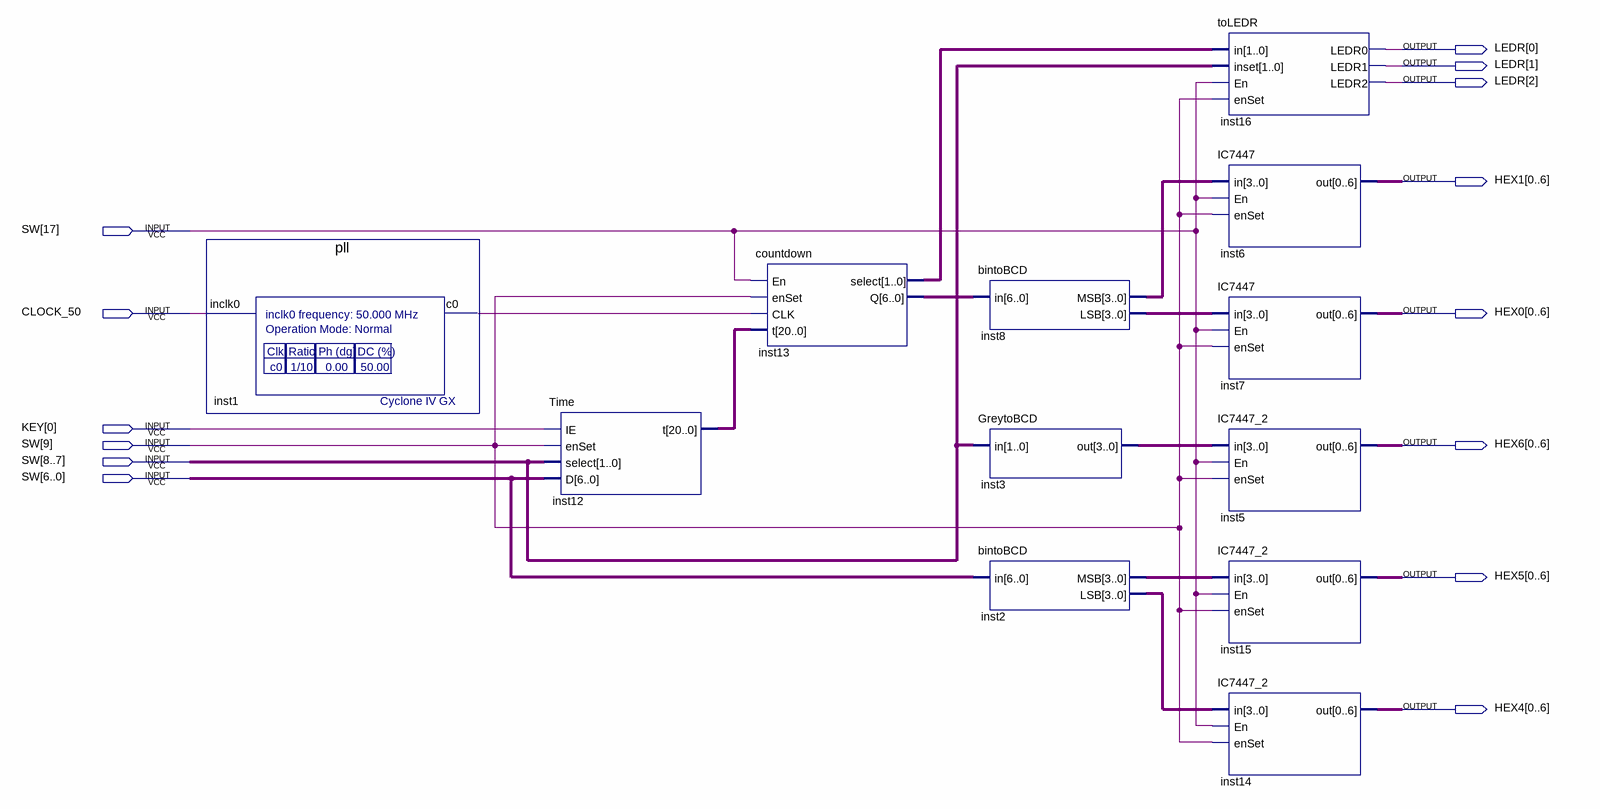
[diagram p0: schematic sheet]
// Quartus schematic MiniProject.bdf as structural Verilog: 12 symbols, 14 pins
module MiniProject (
  input  [17:0] SW,
  input  CLOCK_50,
  input  [0:0] KEY,
  output [2:0] LEDR,
  output [0:6] HEX1,
  output [0:6] HEX0,
  output [0:6] HEX6,
  output [0:6] HEX5,
  output [0:6] HEX4
);

  wire inst1_c0;
  wire [1:0] inst13_select;
  wire [3:0] inst2_lsb, inst2_msb, inst3_out, inst8_lsb, inst8_msb;
  wire [6:0] inst13_q;
  wire [20:0] inst12_t;

  pll inst1 (.inclk0(CLOCK_50), .c0(inst1_c0));
  Time inst12 (.IE(KEY[0]), .enSet(SW[9]), .select(SW[8:7]), .D(SW[6:0]), .t(inst12_t));
  countdown inst13 (.En(SW[17]), .enSet(SW[9]), .CLK(inst1_c0), .t(inst12_t), .select(inst13_select), .Q(inst13_q));
  bintoBCD inst8 (.in(inst13_q), .MSB(inst8_msb), .LSB(inst8_lsb));
  GreytoBCD inst3 (.in(SW[8:7]), .out(inst3_out));
  bintoBCD inst2 (.in(SW[6:0]), .MSB(inst2_msb), .LSB(inst2_lsb));
  toLEDR inst16 (
    .in(inst13_select), .inset(SW[8:7]), .En(SW[17]), .enSet(SW[9]), .LEDR0(LEDR[0]), .LEDR1(LEDR[1]),
    .LEDR2(LEDR[2]));
  IC7447 inst6 (.in(inst8_msb), .En(SW[17]), .enSet(SW[9]), .out(HEX1));
  IC7447 inst7 (.in(inst8_lsb), .En(SW[17]), .enSet(SW[9]), .out(HEX0));
  IC7447_2 inst5 (.in(inst3_out), .En(SW[17]), .enSet(SW[9]), .out(HEX6));
  IC7447_2 inst15 (.in(inst2_msb), .En(SW[17]), .enSet(SW[9]), .out(HEX5));
  IC7447_2 inst14 (.in(inst2_lsb), .En(SW[17]), .enSet(SW[9]), .out(HEX4));
endmodule
